# EAGLE design wiring (EAGLE 7.7.0)

## Sheet 1 of 2
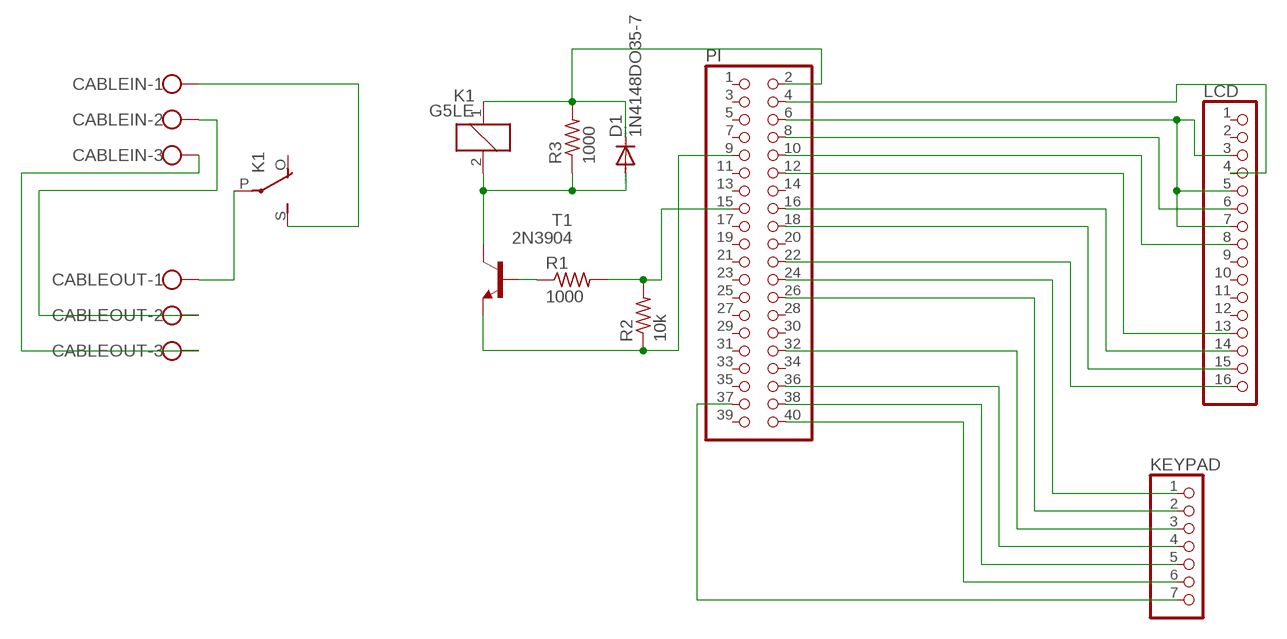
[diagram p0: schematic, sheet 1]

### Parts
CABLEIN  W237-103  [W237-103]
CABLEOUT  W237-103  [W237-103]
D1  1N4148DO35-7  [DO35-7]
K1  G5LE  [G5LE]
KEYPAD  PINHD-1X7  [1X07]
LCD  PINHD-1X16  [1X16]
PI  PINHD-2X20  [2X20]
R1  1000  R-US_0204/5  [0204/5]
R2  10k  R-US_0204/5  [0204/5]
R3  1000  R-US_0204/5  [0204/5]
T1  2N3904  [TO92]

### Nets
N$1: CABLEOUT.1 K1.P(2:P)
N$2: D1.C K1.1 PI.2 R3.2
N$3: CABLEIN.1 K1.S(2:S)
N$4: CABLEIN.2 CABLEOUT.2
N$5: CABLEIN.3 CABLEOUT.3
N$6: LCD.3 LCD.5 LCD.7 PI.6
N$7: LCD.4 PI.4
N$8: LCD.6 PI.8
N$9: LCD.8 PI.10
N$10: LCD.14 PI.16
N$11: LCD.13 PI.12
N$12: LCD.15 PI.18
N$13: LCD.16 PI.22
N$14: KEYPAD.1 PI.24
N$15: KEYPAD.2 PI.26
N$16: D1.A K1.2 R3.1 T1.1(C)
N$17: PI.9 R2.1 T1.3(E)
N$18: PI.15 R1.2 R2.2
N$19: R1.1 T1.2(B)
N$20: KEYPAD.3 PI.32
N$21: KEYPAD.4 PI.36
N$22: KEYPAD.5 PI.38
N$23: KEYPAD.6 PI.40
N$24: KEYPAD.7 PI.37
Unconnected: K1.O(2:O) LCD.1 LCD.2 LCD.9 LCD.10 LCD.11 LCD.12 PI.1 PI.3 PI.5 PI.7 PI.11 PI.13 PI.14 PI.17 PI.19 PI.20 PI.21 PI.23 PI.25 PI.27 PI.28 PI.29 PI.30 PI.31 PI.33 PI.34 PI.35 PI.39

## Sheet 2 of 2

## Library data of the parts
CABLEIN CABLEOUT = con-wago-500:W237-103: WAGO SCREW CLAMP; MPN: 237-103; OC_FARNELL: unknown; OC_NEWARK: 18M7116
D1 = diode:1N4148: DIODE high speed (Philips)
K1 = relay:G5LE: RELAY 1 x switch, 10 A/120 V AC, 8 A/30 V DC, Omron; OC_FARNELL: unknown; OC_NEWARK: unknown
KEYPAD = pinhead:PINHD-1X7: PIN HEADER
LCD = pinhead:PINHD-1X16: PIN HEADER
PI = pinhead:PINHD-2X20: PIN HEADER
R1-R3 = resistor:R-US_: RESISTOR, American symbol
T1 = transistor:2N3904: NPN TRANSISTOR

## Board
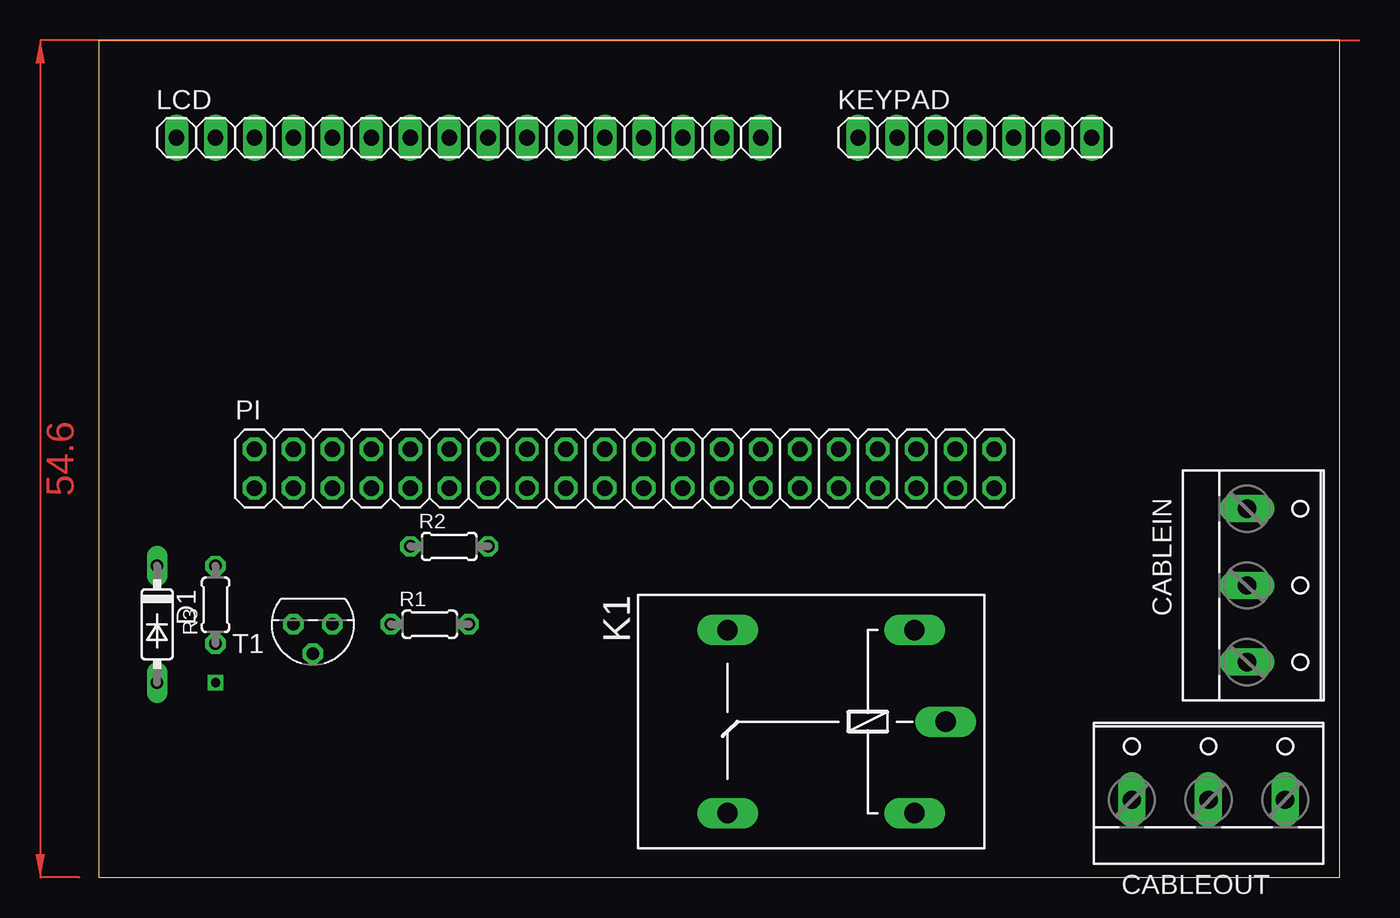
[diagram p1: board, top side]
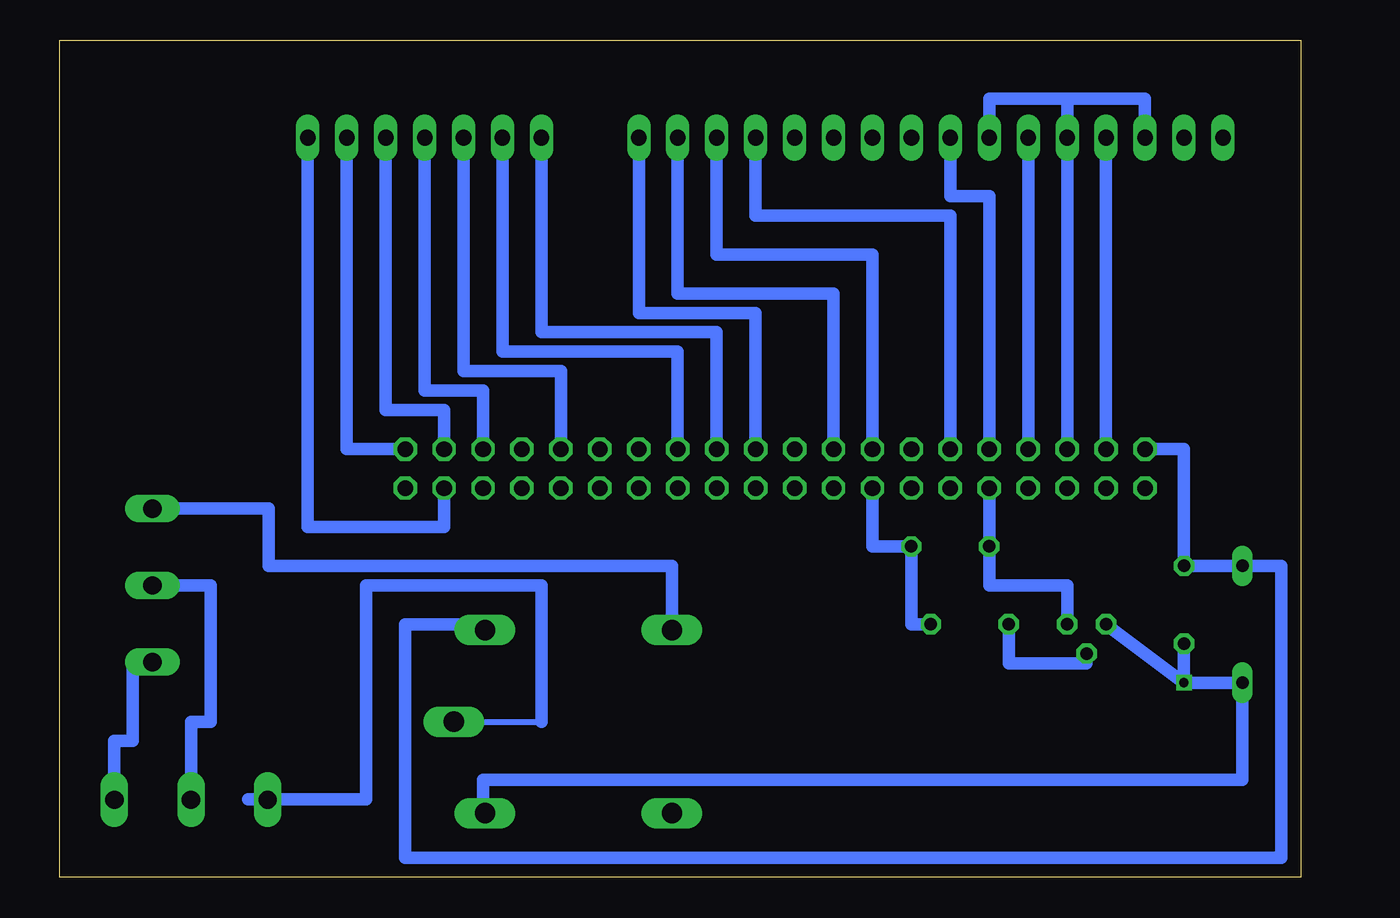
[diagram p2: board, bottom side, seen from below]

Size 80.95 x 54.6 mm. Coordinates in mm from the lower left corner, seen from the top.
Outline: 0,0 80.95,0 80.95,54.6 0,54.6 0,0
Copper layers (1*16): Top 0.035mm / dielectric 1.5mm / Bottom 0.035mm
Design rules "default": minimum track width 10mil, minimum drill 24mil, track to track 8mil, track to pad 8mil, pad to pad 8mil, via to via 8mil, smd to smd 8mil, copper to edge 40mil, drill to drill 8mil, minimum pad ring 10mil, minimum via ring 8mil, stop-mask expansion 4mil, vias tented up to drill 0mil, thermal gap 10mil

### Footprints (pad centres in the part's own frame; a part is rotated, then mirrored left to right if it is on the bottom)
W237-103 = drill 1.194 long: 1 -5,-1.29; 2 0,-1.29; 3 5,-1.29
DO35-7 = drill 0.813 long: A 3.81,0; C -3.81,0
G5LE = drill 1.321 long: 1 -7.493,-5.969; 2 -7.493,5.969; O 4.699,5.969; P -9.525,0; S 4.699,-5.969
1X07 = drill 1.016 long: 1 -7.62,0; 2 -5.08,0; 3 -2.54,0; 4 0,0; 5 2.54,0; 6 5.08,0; 7 7.62,0
1X16 = drill 1.016 long: 1 -19.05,0; 2 -16.51,0; 3 -13.97,0; 4 -11.43,0; 5 -8.89,0; 6 -6.35,0; 7 -3.81,0; 8 -1.27,0; 9 1.27,0; 10 3.81,0; 11 6.35,0; 12 8.89,0; 13 11.43,0; 14 13.97,0; 15 16.51,0; 16 19.05,0
2X20 = drill 1.016 octagon: 1 -24.13,-1.27; 2 -24.13,1.27; 3 -21.59,-1.27; 4 -21.59,1.27; 5 -19.05,-1.27; 6 -19.05,1.27; 7 -16.51,-1.27; 8 -16.51,1.27; 9 -13.97,-1.27; 10 -13.97,1.27; 11 -11.43,-1.27; 12 -11.43,1.27; 13 -8.89,-1.27; 14 -8.89,1.27; 15 -6.35,-1.27; 16 -6.35,1.27; 17 -3.81,-1.27; 18 -3.81,1.27; 19 -1.27,-1.27; 20 -1.27,1.27; 21 1.27,-1.27; 22 1.27,1.27; 23 3.81,-1.27; 24 3.81,1.27; 25 6.35,-1.27; 26 6.35,1.27; 27 8.89,-1.27; 28 8.89,1.27; 29 11.43,-1.27; 30 11.43,1.27; 31 13.97,-1.27; 32 13.97,1.27; 33 16.51,-1.27; 34 16.51,1.27; 35 19.05,-1.27; 36 19.05,1.27; 37 21.59,-1.27; 38 21.59,1.27; 39 24.13,-1.27; 40 24.13,1.27
0204/5 = drill 0.813 octagon: 1 -2.54,0; 2 2.54,0
TO92 = drill 0.813 octagon: 1 1.27,0; 2 0,1.905; 3 -1.27,0

### Placement (x,y rotation side)
CABLEIN  76.2,19.05 270 top
CABLEOUT  72.39,6.35 0 top
D1  3.81,16.51 270 top
K1  45.72,10.16 180 top
KEYPAD  57.15,48.26 0 top
LCD  24.13,48.26 0 top
PI  34.29,26.67 0 top
R1  21.59,16.51 0 top
R2  22.86,21.59 0 top
R3  7.62,17.78 90 top
T1  13.97,16.51 180 top

### Tracks (layer width: path | path; a pad name or v marks a point on that pad's centre or on a via)
N$1
  Bottom 0.406: K1.P 49.53,10.16 | 68.66,5.08 CABLEOUT.1
  Bottom 0.813: 49.53,10.16 49.53,19.05 60.96,19.05 60.96,5.08 68.66,5.08
N$2
  Bottom 0.406: 53.21,16.51 K1.1
  Bottom 0.813: PI.2 7.62,27.94 R3.2 D1.C 1.27,20.32 1.27,1.27 58.42,1.27 58.42,16.51 53.21,16.51
N$3
  Bottom 0.813: CABLEIN.1 67.31,24.05 67.31,20.32 41.02,20.32 K1.S
N$4
  Bottom 0.813: CABLEIN.2 71.12,19.05 71.12,10.16 72.39,10.16 CABLEOUT.2
N$5
  Bottom 0.813: CABLEOUT.3 77.39,8.89 76.2,8.89 76.2,14.05 CABLEIN.3
N$6
  Bottom 0.813: PI.6 LCD.5 15.24,50.8 | LCD.3 10.16,50.8 15.24,50.8 | 15.24,50.8 20.32,50.8 LCD.7
N$7
  Bottom 0.813: PI.4 LCD.4
N$8
  Bottom 0.813: LCD.6 PI.8
N$9
  Bottom 0.813: PI.10 20.32,44.45 22.86,44.45 LCD.8
N$10
  Bottom 0.813: PI.16 27.94,40.64 38.1,40.64 LCD.14
N$11
  Bottom 0.813: PI.12 22.86,43.18 35.56,43.18 LCD.13
N$12
  Bottom 0.813: PI.18 30.48,38.1 40.64,38.1 LCD.15
N$13
  Bottom 0.813: PI.22 35.56,36.83 43.18,36.83 LCD.16
N$14
  Bottom 0.813: PI.24 38.1,35.56 49.53,35.56 KEYPAD.1
N$15
  Bottom 0.813: PI.26 40.64,34.29 52.07,34.29 KEYPAD.2
N$16  (via drill 0.6)
  Bottom 0.406: K1.2 53.34,4.19
  Bottom 0.813: R3.1 v7.62,12.7 | v7.62,12.7 T1.1 | v7.62,12.7 D1.A 3.81,6.35 53.34,6.35 53.34,4.19
N$17
  Bottom 0.813: PI.9 R2.1 20.32,19.05 15.24,19.05 T1.3
N$18
  Bottom 0.813: PI.15 27.94,21.59 R2.2 25.4,16.51 R1.2
N$19
  Bottom 0.406: 13.97,13.97 T1.2
  Bottom 0.813: R1.1 19.05,13.97 13.97,13.97
N$20
  Bottom 0.813: PI.32 48.26,33.02 54.61,33.02 KEYPAD.3
N$21
  Bottom 0.813: PI.36 53.34,31.75 57.15,31.75 KEYPAD.4
N$22
  Bottom 0.813: PI.38 55.88,30.48 59.69,30.48 KEYPAD.5
N$23
  Bottom 0.813: PI.40 62.23,27.94 KEYPAD.6
N$24
  Bottom 0.813: PI.37 55.88,22.86 64.77,22.86 KEYPAD.7
(copper drawn outside any net)
  shapes: Top area x2